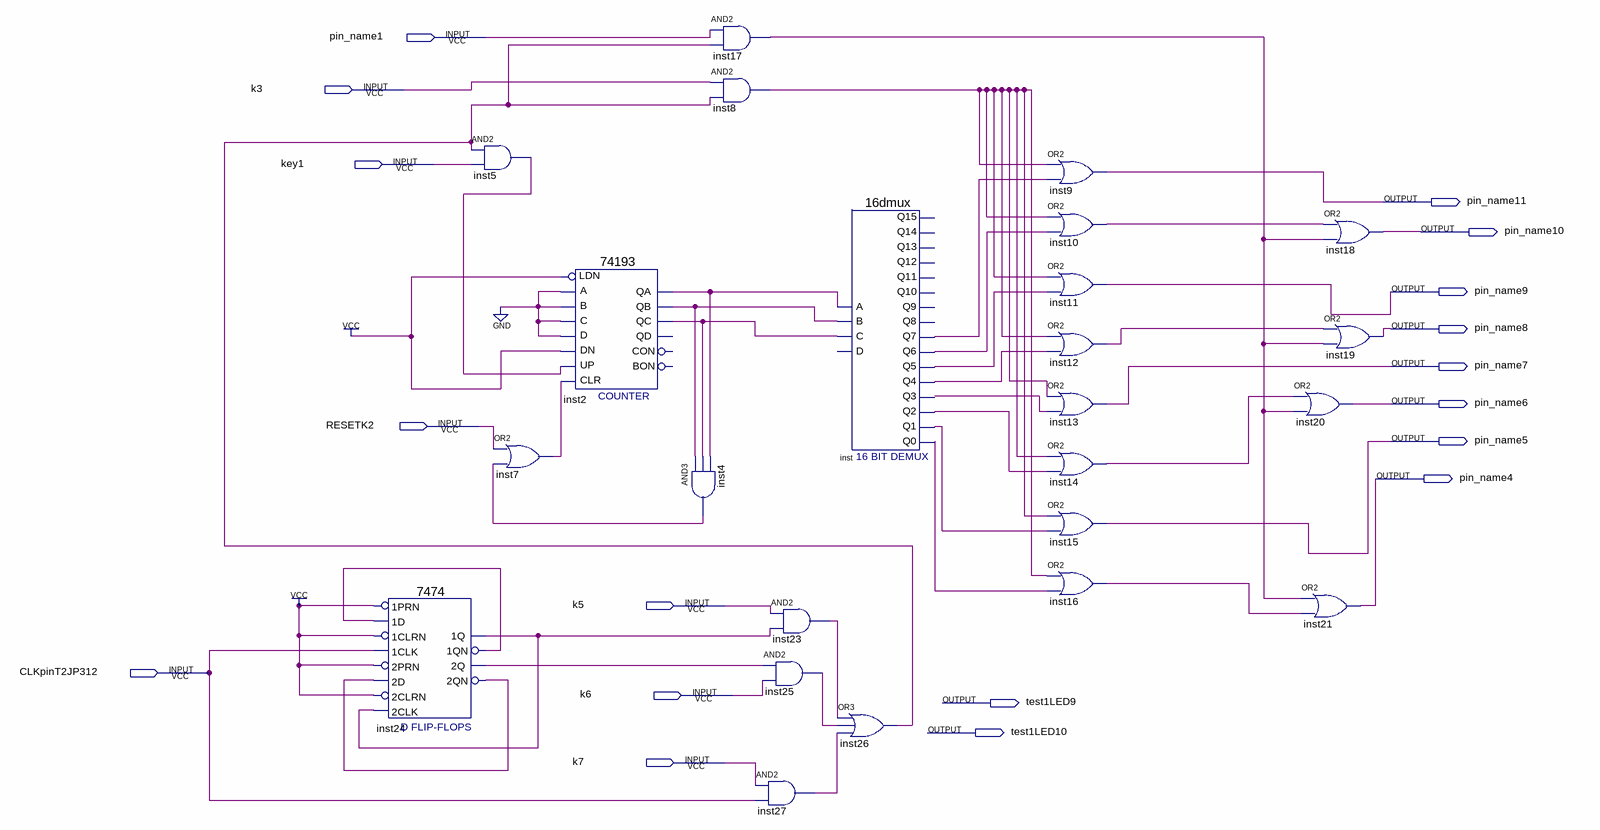
[diagram p0: schematic sheet]
// Quartus schematic exp1.bdf as structural Verilog: 24 symbols, 18 pins
module exp1 (
  input  pin_name1,
  input  k3,
  input  key1,
  input  RESETK2,
  input  k5,
  input  CLKpinT2JP312,
  input  k6,
  input  k7,
  output pin_name11,
  output pin_name10,
  output pin_name9,
  output pin_name8,
  output pin_name7,
  output pin_name6,
  output pin_name5,
  output pin_name4,
  output test1LED9,
  output test1LED10
);

  wire inst2_qa, inst2_qb, inst2_qc, inst4_out, inst5_out, inst7_out, inst8_out, inst10_out, inst12_out,
       inst14_out, inst16_out, inst17_out, inst23_out, inst24_1q, inst24_1qn, inst24_2q, inst24_2qn,
       inst25_out, inst26_out, inst27_out, inst_q0, inst_q1, inst_q2, inst_q3, inst_q4, inst_q5, inst_q6,
       inst_q7;

  \7474  inst24 (
    .\2D (inst24_2qn), .\2PRN (1'b1), .\1CLK (CLKpinT2JP312), .\1D (inst24_1qn), .\1PRN (1'b1),
    .\2CLK (inst24_1q), .\2CLRN (1'b1), .\1CLRN (1'b1), .\1QN (inst24_1qn), .\2Q (inst24_2q),
    .\2QN (inst24_2qn), .\1Q (inst24_1q));
  and inst5 (inst5_out, inst26_out, key1);
  or inst7 (inst7_out, RESETK2, inst4_out);
  \74193  inst2 (
    .D(1'b0), .C(1'b0), .B(1'b0), .A(1'b0), .CLR(inst7_out), .UP(inst5_out), .DN(1'b1), .LDN(1'b1),
    .QB(inst2_qb), .QA(inst2_qa), .QC(inst2_qc));  // open: CON, QD, BON
  and inst4 (inst4_out, inst2_qb, inst2_qc, inst2_qa);
  and inst17 (inst17_out, pin_name1, inst26_out);
  and inst8 (inst8_out, k3, inst26_out);
  and inst27 (inst27_out, k7, CLKpinT2JP312);
  and inst23 (inst23_out, k5, inst24_1q);
  and inst25 (inst25_out, inst24_2q, k6);
  \16dmux  inst (
    .C(inst2_qc), .B(inst2_qb), .A(inst2_qa), .Q7(inst_q7), .Q4(inst_q4), .Q5(inst_q5), .Q6(inst_q6),
    .Q2(inst_q2), .Q3(inst_q3), .Q0(inst_q0), .Q1(inst_q1));  // open: D, Q12, Q13, Q11, Q9, Q10, Q8, Q14, Q15
  or inst26 (inst26_out, inst23_out, inst25_out, inst27_out);
  or inst9 (pin_name11, inst8_out, inst_q7);
  or inst10 (inst10_out, inst8_out, inst_q6);
  or inst11 (pin_name9, inst8_out, inst_q5);
  or inst12 (inst12_out, inst8_out, inst_q4);
  or inst13 (pin_name7, inst8_out, inst_q3);
  or inst14 (inst14_out, inst8_out, inst_q2);
  or inst15 (pin_name5, inst8_out, inst_q1);
  or inst16 (inst16_out, inst8_out, inst_q0);
  or inst20 (pin_name6, inst14_out, inst17_out);
  or inst18 (pin_name10, inst10_out, inst17_out);
  or inst19 (pin_name8, inst12_out, inst17_out);
  or inst21 (pin_name4, inst17_out, inst16_out);
endmodule
